# EasyEDA schematic led-flex.json
TITLE: Sheet_1; REV: 1.0; Date: 2024-04-20; Sheet: 1/1; Company: Your Company
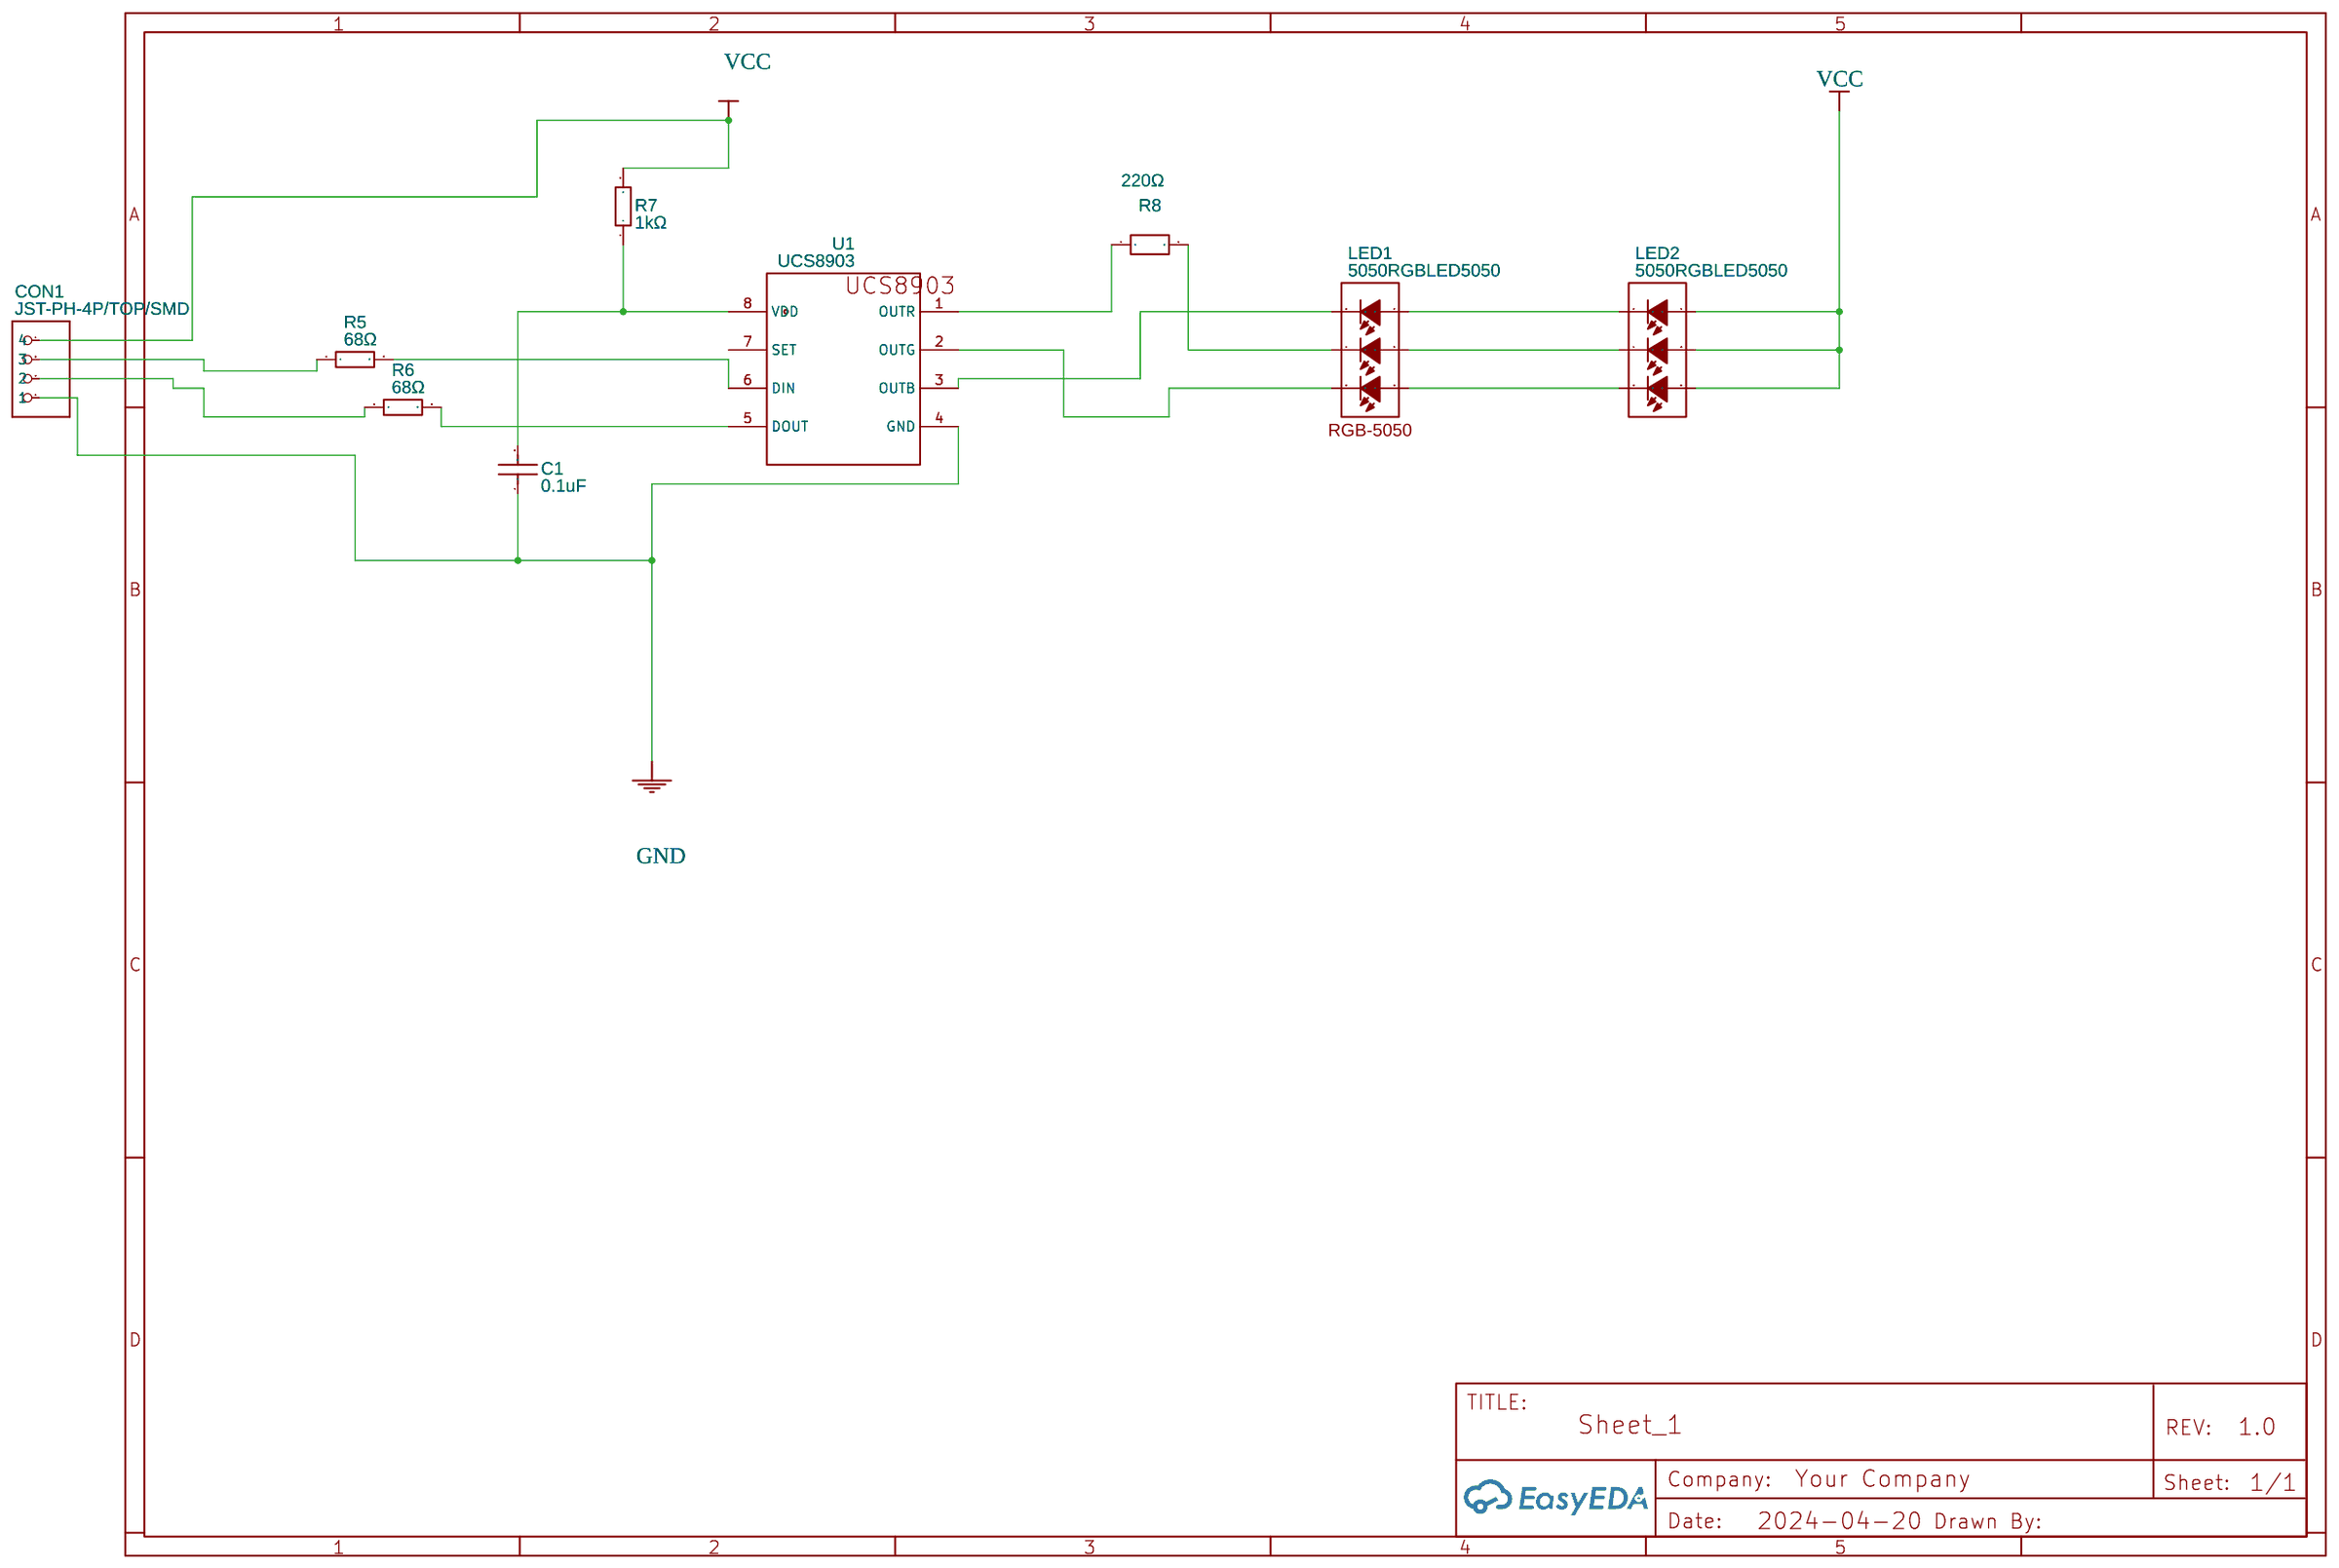
[diagram p0: schematic sheet]

## Parts
C1  0.1uF  [SMD-0805-CAPACITOR WK]
CON1  JST-PH-4P/TOP/SMD  [JST-PH-4P-TOP/SMD]
LED1  5050RGBLED5050  [RGB-5050]
LED2  5050RGBLED5050  [RGB-5050]
R5  68Ω  [R1210]
R6  68Ω  [R1210]
R7  1kΩ  [R1210]
R8  220Ω  [R1210]
U1  UCS8903  [SOP-8_L5.0-W4.4-P1.27-LS6.2-BL]

## Library data of the parts
C1 = KONDENSATOR SMD: Manufacturer Part: Resisitor MF25 470, 0.25W; Supplier Part: 934-1943; Supplier: Element14; link: http://www.farnell.com/datasheets/1716726.pdf?_ga=2.200856808.715801181.1515396489-258607356.1495180379; Contributor: dennis dancun
CON1 = JST-PH-4P/TOP/SMD: Contributor: liaoqinyi
LED1 = 5050RGBLED5050: Supplier Part: C26544; Supplier: LCSC; Manufacturer: ReliaPro; Manufacturer Part: 5050RGBSMDLEDLamp beads 5050Bright red and blue; Contributor: SitarUs; Package Display: Yes
LED2 = 5050RGBLED5050: Supplier Part: C26544; Supplier: LCSC; Manufacturer: ReliaPro; Manufacturer Part: 5050RGBSMDLEDLamp beads 5050Bright red and blue; Contributor: SitarUs
R5 R6 = 1210W2J0680T5E: Contributor: LCSC; Supplier: LCSC; Supplier Part: C473019; Manufacturer: UNI-ROYAL(厚声); JLCPCB Part Class: Extended Part
R7 = RTT12102JTP: Supplier: LCSC; Manufacturer: RALEC(旺诠); Supplier Part: C104959; JLCPCB Part Class: Extended Part
R8 = RTT122200FTP: Contributor: LCSC; Supplier: LCSC; Supplier Part: C305056; Manufacturer: RALEC(旺诠); JLCPCB Part Class: Extended Part
U1 = UCS8903: Contributor: emil_rh

## Nets
GND: C1.1 CON1.1 U1.4(GND)
VCC: CON1.4 LED2.1(A) LED2.3(A) LED2.5(A) R7.2
Net-(C1-2): C1.2 R7.1 U1.8(VDD)
Net-(CON1-2): CON1.2 R6.1
Net-(CON1-3): CON1.3 R5.1
Net-(LED1-1): LED1.1(A) LED2.2(K)
Net-(LED1-2): LED1.2(K) U1.3(OUTB)
Net-(LED1-3): LED1.3(A) LED2.4(K)
Net-(LED1-4): LED1.4(K) R8.2
Net-(LED1-5): LED1.5(A) LED2.6(K)
Net-(LED1-6): LED1.6(K) U1.2(OUTG)
Net-(R5-2): R5.2 U1.6(DIN)
Net-(R6-2): R6.2 U1.5(DOUT)
Net-(R8-1): R8.1 U1.1(OUTR)

Not connected (* = marked no-connect by the designer): U1 7(SET)
